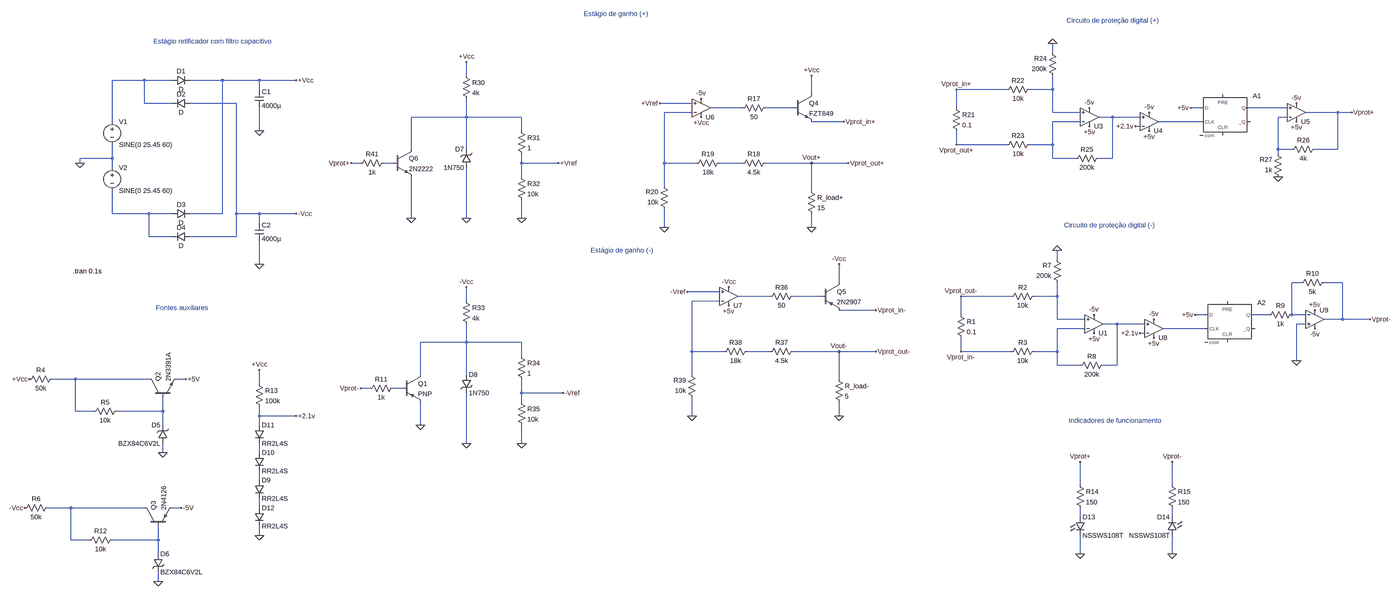
[diagram p0: schematic Fonte.asc, whole sheet]
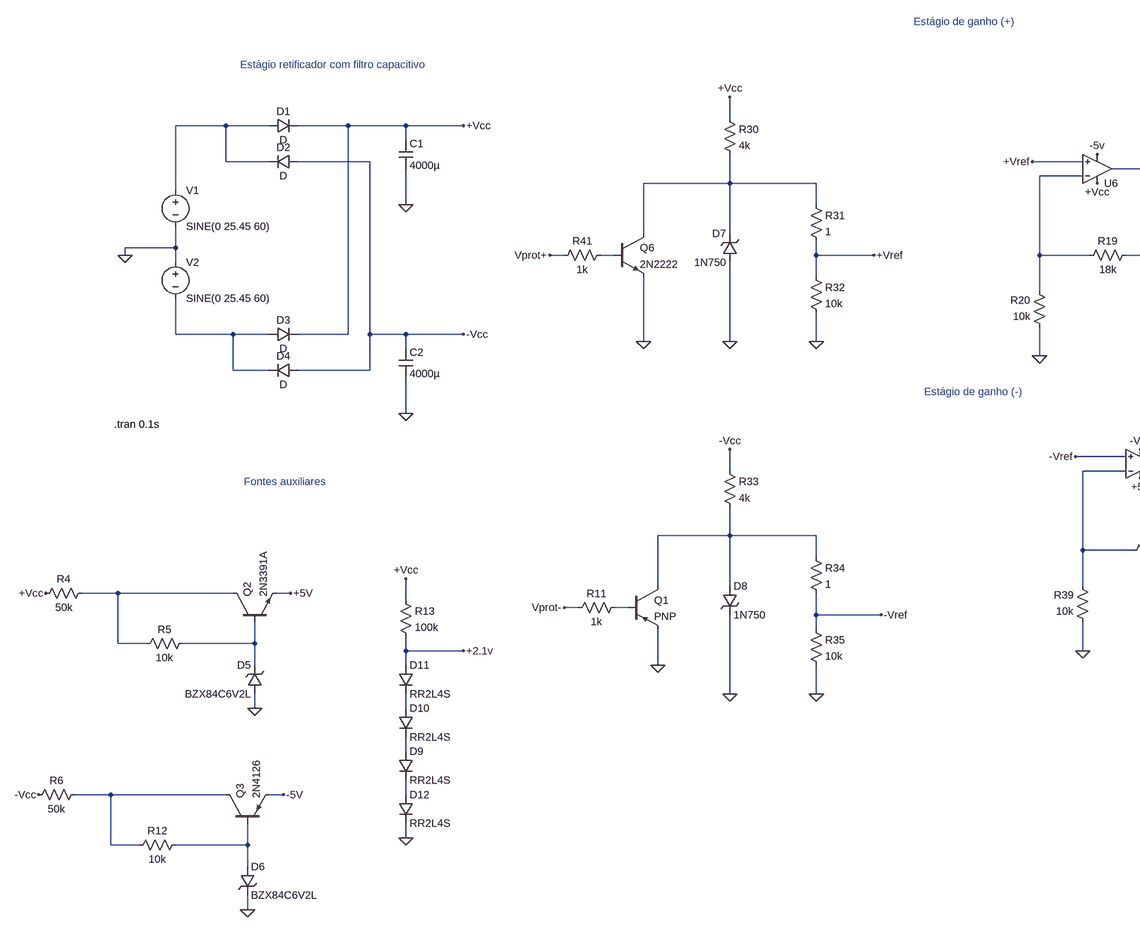
[diagram p1: schematic Fonte.asc, part, row 1 of 1, column 1 of 2]
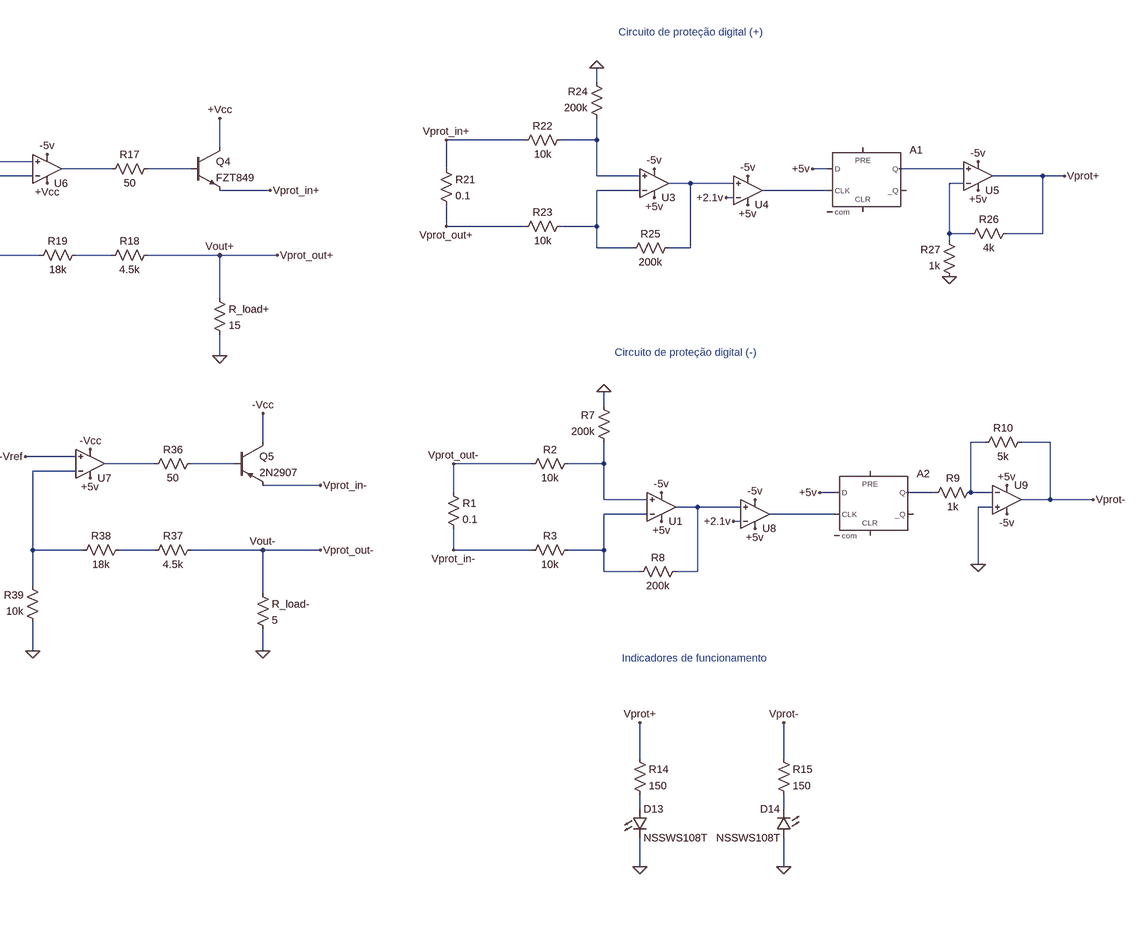
[diagram p2: schematic Fonte.asc, part, row 1 of 1, column 2 of 2]
Fonte.asc, the LTspice schematic file:
Version 4
SHEET 1 8760 7992
WIRE 3504 -208 3504 -240
WIRE 1264 -128 1264 -176
WIRE 144 -112 32 -112
WIRE 240 -112 144 -112
WIRE 416 -112 304 -112
WIRE 544 -112 416 -112
WIRE 672 -112 544 -112
WIRE 544 -80 544 -112
WIRE 3344 -80 3168 -80
WIRE 3504 -80 3504 -128
WIRE 3504 -80 3424 -80
WIRE 2464 -64 2464 -128
WIRE 144 -32 144 -112
WIRE 240 -32 144 -32
WIRE 464 -32 304 -32
WIRE 2048 -32 1936 -32
WIRE 2224 -16 2112 -16
WIRE 2400 -16 2304 -16
WIRE 3168 -16 3168 -80
WIRE 4016 -16 3984 -16
WIRE 4320 -16 4176 -16
WIRE 2048 0 1952 0
WIRE 3504 0 3504 -80
WIRE 3600 0 3504 0
WIRE 4496 0 4384 0
WIRE 4544 0 4496 0
WIRE 1264 16 1264 -48
WIRE 1264 16 1072 16
WIRE 1456 16 1264 16
WIRE 3712 16 3664 16
WIRE 3808 16 3712 16
WIRE 4320 16 4288 16
WIRE 32 32 32 -112
WIRE 2576 32 2464 32
WIRE 3600 32 3504 32
WIRE 4016 32 3872 32
WIRE 3808 48 3792 48
WIRE 544 64 544 -16
WIRE 1456 64 1456 16
WIRE 3168 112 3168 64
WIRE 3344 112 3168 112
WIRE 3504 112 3504 32
WIRE 3504 112 3424 112
WIRE 1072 128 1072 16
WIRE 1264 128 1264 16
WIRE 4288 128 4288 16
WIRE 4336 128 4288 128
WIRE 4496 128 4496 0
WIRE 4496 128 4416 128
WIRE 4288 144 4288 128
WIRE 32 160 32 112
WIRE 32 160 -80 160
WIRE 3504 160 3504 112
WIRE 3584 160 3504 160
WIRE 3712 160 3712 16
WIRE 3712 160 3664 160
WIRE -80 176 -80 160
WIRE 896 176 864 176
WIRE 1008 176 976 176
WIRE 1456 176 1456 144
WIRE 1584 176 1456 176
WIRE 1952 176 1952 0
WIRE 2064 176 1952 176
WIRE 2224 176 2144 176
WIRE 2464 176 2304 176
WIRE 2592 176 2464 176
WIRE 32 192 32 160
WIRE 1456 224 1456 176
WIRE 1952 256 1952 176
WIRE 2464 272 2464 176
WIRE 32 352 32 272
WIRE 160 352 32 352
WIRE 240 352 160 352
WIRE 416 352 416 -112
WIRE 416 352 304 352
WIRE 464 352 464 -32
WIRE 544 352 464 352
WIRE 672 352 544 352
WIRE 1072 368 1072 224
WIRE 1264 368 1264 192
WIRE 1456 368 1456 304
WIRE 544 384 544 352
WIRE 1952 400 1952 336
WIRE 2464 400 2464 352
WIRE 160 432 160 352
WIRE 240 432 160 432
WIRE 464 432 464 352
WIRE 464 432 304 432
WIRE 3520 512 3520 480
WIRE 544 528 544 448
WIRE 2560 592 2560 528
WIRE 4368 592 4336 592
WIRE 4512 592 4448 592
WIRE 2144 624 2032 624
WIRE 2320 640 2208 640
WIRE 2496 640 2400 640
WIRE 3360 640 3184 640
WIRE 3520 640 3520 592
WIRE 3520 640 3440 640
WIRE 1264 656 1264 608
WIRE 2144 656 2048 656
WIRE 2688 688 2560 688
WIRE 3184 704 3184 640
WIRE 4032 704 4000 704
WIRE 4256 704 4192 704
WIRE 4336 704 4336 592
WIRE 4384 704 4336 704
WIRE 3520 720 3520 640
WIRE 3616 720 3520 720
WIRE 4512 720 4512 592
WIRE 4512 720 4448 720
WIRE 4608 720 4512 720
WIRE 3728 736 3680 736
WIRE 3824 736 3728 736
WIRE 4384 736 4352 736
WIRE 3616 752 3520 752
WIRE 4032 752 3888 752
WIRE 3824 768 3808 768
WIRE 1264 800 1264 736
WIRE 1264 800 1104 800
WIRE 1456 800 1264 800
WIRE 2048 832 2048 656
WIRE 2160 832 2048 832
WIRE 2320 832 2240 832
WIRE 2560 832 2400 832
WIRE 2688 832 2560 832
WIRE 3184 832 3184 784
WIRE 3360 832 3184 832
WIRE 3520 832 3520 752
WIRE 3520 832 3440 832
WIRE 1456 848 1456 800
WIRE 4352 864 4352 736
WIRE 3520 880 3520 832
WIRE 3600 880 3520 880
WIRE 3728 880 3728 736
WIRE 3728 880 3680 880
WIRE 1104 912 1104 800
WIRE 1264 912 1264 800
WIRE 2048 912 2048 832
WIRE -96 928 -176 928
WIRE 160 928 -96 928
WIRE 288 928 256 928
WIRE 2560 928 2560 832
WIRE 544 944 544 896
WIRE 928 960 896 960
WIRE 1040 960 1008 960
WIRE 1456 976 1456 928
WIRE 1600 976 1456 976
WIRE 1456 1008 1456 976
WIRE -96 1040 -96 928
WIRE -32 1040 -96 1040
WIRE 208 1040 208 992
WIRE 208 1040 48 1040
WIRE 544 1056 544 1024
WIRE 672 1056 544 1056
WIRE 2048 1056 2048 992
WIRE 2560 1056 2560 1008
WIRE 208 1088 208 1040
WIRE 544 1088 544 1056
WIRE 1104 1088 1104 1008
WIRE 1264 1152 1264 976
WIRE 1456 1152 1456 1088
WIRE 208 1184 208 1152
WIRE 544 1184 544 1152
WIRE 544 1280 544 1248
WIRE 3600 1296 3600 1216
WIRE 3920 1296 3920 1216
WIRE -112 1376 -192 1376
WIRE 144 1376 -112 1376
WIRE 272 1376 240 1376
WIRE 544 1376 544 1344
WIRE 3600 1408 3600 1376
WIRE 3920 1408 3920 1376
WIRE 544 1472 544 1440
WIRE -112 1488 -112 1376
WIRE -48 1488 -112 1488
WIRE 192 1488 192 1440
WIRE 192 1488 32 1488
WIRE 192 1536 192 1488
WIRE 3600 1536 3600 1472
WIRE 3920 1536 3920 1472
WIRE 192 1632 192 1600
FLAG -80 176 0
FLAG 544 64 0
FLAG 544 528 0
FLAG 672 -112 +Vcc
FLAG 672 352 -Vcc
FLAG 3504 -240 0
FLAG 3632 48 +5v
FLAG 3632 -16 -5v
FLAG 3840 0 -5v
FLAG 3840 64 +5v
FLAG 3792 48 +2.1v
FLAG 3984 -16 +5v
FLAG 4288 224 0
FLAG 4544 0 Vprot+
FLAG 3168 -80 Vprot_in+
FLAG 3168 112 Vprot_out+
FLAG 4352 -32 -5v
FLAG 4352 32 +5v
FLAG 1936 -32 +Vref
FLAG 2080 16 +Vcc
FLAG 2080 -48 -5v
FLAG 2464 400 0
FLAG 1952 400 0
FLAG 2464 -128 +Vcc
FLAG 1264 368 0
FLAG 1456 368 0
FLAG 1264 -176 +Vcc
FLAG 1584 176 +Vref
FLAG 1264 1152 0
FLAG 1456 1152 0
FLAG 1264 608 -Vcc
FLAG 1600 976 -Vref
FLAG 2032 624 -Vref
FLAG 2176 672 +5v
FLAG 2176 608 -Vcc
FLAG 2560 1056 0
FLAG 2048 1056 0
FLAG 2560 528 -Vcc
FLAG 864 176 Vprot+
FLAG 1072 368 0
FLAG 2576 32 Vprot_in+
FLAG 2592 176 Vprot_out+
FLAG 2688 688 Vprot_in-
FLAG 2688 832 Vprot_out-
FLAG 3520 480 0
FLAG 3648 768 +5v
FLAG 3648 704 -5v
FLAG 3856 720 -5v
FLAG 3856 784 +5v
FLAG 3808 768 +2.1v
FLAG 4000 704 +5v
FLAG 4352 864 0
FLAG 4608 720 Vprot-
FLAG 3184 640 Vprot_out-
FLAG 3184 832 Vprot_in-
FLAG 4416 752 -5v
FLAG 4416 688 +5v
FLAG 896 960 Vprot-
FLAG 1104 1088 0
FLAG 2560 832 Vout-
FLAG 2464 176 Vout+
FLAG 208 1184 0
FLAG -256 928 +Vcc
FLAG 288 928 +5V
FLAG 192 1632 0
FLAG -272 1376 -Vcc
FLAG 272 1376 -5V
FLAG 544 896 +Vcc
FLAG 544 1472 0
FLAG 672 1056 +2.1v
FLAG 3600 1536 0
FLAG 3920 1536 0
FLAG 3600 1216 Vprot+
FLAG 3920 1216 Vprot-
SYMBOL voltage 32 16 R0
SYMATTR InstName V1
SYMATTR Value SINE(0 25.45 60)
SYMBOL voltage 32 176 R0
SYMATTR InstName V2
SYMATTR Value SINE(0 25.45 60)
SYMBOL diode 240 -96 R270
WINDOW 0 32 32 VTop 2
WINDOW 3 0 32 VBottom 2
SYMATTR InstName D1
SYMBOL diode 304 -48 R90
WINDOW 0 0 32 VBottom 2
WINDOW 3 32 32 VTop 2
SYMATTR InstName D2
SYMBOL diode 240 368 R270
WINDOW 0 32 32 VTop 2
WINDOW 3 0 32 VBottom 2
SYMATTR InstName D3
SYMBOL diode 304 416 R90
WINDOW 0 0 32 VBottom 2
WINDOW 3 32 32 VTop 2
SYMATTR InstName D4
SYMBOL cap 528 -80 R0
SYMATTR InstName C1
SYMATTR Value 4000µ
SYMBOL cap 528 384 R0
SYMATTR InstName C2
SYMATTR Value 4000µ
SYMBOL res 3152 -32 R0
SYMATTR InstName R21
SYMATTR Value 0.1
SYMBOL res 3440 -96 R90
WINDOW 0 0 56 VBottom 2
WINDOW 3 32 56 VTop 2
SYMATTR InstName R22
SYMATTR Value 10k
SYMBOL res 3440 96 R90
WINDOW 0 0 56 VBottom 2
WINDOW 3 32 56 VTop 2
SYMATTR InstName R23
SYMATTR Value 10k
SYMBOL res 3520 -112 R180
WINDOW 0 36 76 Left 2
WINDOW 3 36 40 Left 2
SYMATTR InstName R24
SYMATTR Value 200k
SYMBOL res 3568 176 R270
WINDOW 0 32 56 VTop 2
WINDOW 3 0 56 VBottom 2
SYMATTR InstName R25
SYMATTR Value 200k
SYMBOL Opamps\\UniversalOpamp2 3632 16 M180
SYMATTR InstName U3
SYMBOL Opamps\\UniversalOpamp2 3840 32 M180
SYMATTR InstName U4
SYMBOL Digital\\dflop 4096 -64 R0
SYMATTR InstName A1
SYMBOL Opamps\\UniversalOpamp2 4352 0 M180
SYMATTR InstName U5
SYMBOL res 4432 112 R90
WINDOW 0 0 56 VBottom 2
WINDOW 3 32 56 VTop 2
SYMATTR InstName R26
SYMATTR Value 4k
SYMBOL res 4304 240 R180
WINDOW 0 36 76 Left 2
WINDOW 3 36 40 Left 2
SYMATTR InstName R27
SYMATTR Value 1k
SYMBOL res 2320 -32 R90
WINDOW 0 0 56 VBottom 2
WINDOW 3 32 56 VTop 2
SYMATTR InstName R17
SYMATTR Value 50
SYMBOL res 2320 160 R90
WINDOW 0 0 56 VBottom 2
WINDOW 3 32 56 VTop 2
SYMATTR InstName R18
SYMATTR Value 4.5k
SYMBOL res 2160 160 R90
WINDOW 0 0 56 VBottom 2
WINDOW 3 32 56 VTop 2
SYMATTR InstName R19
SYMATTR Value 18k
SYMBOL res 1968 352 R180
WINDOW 0 36 76 Left 2
WINDOW 3 36 40 Left 2
SYMATTR InstName R20
SYMATTR Value 10k
SYMBOL res 2448 256 R0
SYMATTR InstName R_load+
SYMATTR Value 15
SYMBOL npn 2400 -64 R0
SYMATTR InstName Q4
SYMATTR Value FZT849
SYMBOL OpAmps\\UniversalOpamp2 2080 -16 M180
SYMATTR InstName U6
SYMBOL res 1248 -144 R0
SYMATTR InstName R30
SYMATTR Value 4k
SYMBOL zener 1280 192 R180
WINDOW 0 24 64 Left 2
WINDOW 3 24 0 Left 2
SYMATTR InstName D7
SYMATTR Value 1N750
SYMBOL res 1440 48 R0
SYMATTR InstName R31
SYMATTR Value 1
SYMBOL res 1440 208 R0
SYMATTR InstName R32
SYMATTR Value 10k
SYMBOL res 1248 640 R0
SYMATTR InstName R33
SYMATTR Value 4k
SYMBOL zener 1248 912 R0
SYMATTR InstName D8
SYMATTR Value 1N750
SYMBOL res 1440 832 R0
SYMATTR InstName R34
SYMATTR Value 1
SYMBOL res 1440 992 R0
SYMATTR InstName R35
SYMATTR Value 10k
SYMBOL res 2416 624 R90
WINDOW 0 0 56 VBottom 2
WINDOW 3 32 56 VTop 2
SYMATTR InstName R36
SYMATTR Value 50
SYMBOL res 2416 816 R90
WINDOW 0 0 56 VBottom 2
WINDOW 3 32 56 VTop 2
SYMATTR InstName R37
SYMATTR Value 4.5k
SYMBOL res 2256 816 R90
WINDOW 0 0 56 VBottom 2
WINDOW 3 32 56 VTop 2
SYMATTR InstName R38
SYMATTR Value 18k
SYMBOL res 2064 1008 R180
WINDOW 0 36 76 Left 2
WINDOW 3 36 40 Left 2
SYMATTR InstName R39
SYMATTR Value 10k
SYMBOL res 2544 912 R0
SYMATTR InstName R_load-
SYMATTR Value 5
SYMBOL OpAmps\\UniversalOpamp2 2176 640 M180
SYMATTR InstName U7
SYMBOL pnp 2496 592 R0
SYMATTR InstName Q5
SYMATTR Value 2N2907
SYMBOL npn 1008 128 R0
SYMATTR InstName Q6
SYMATTR Value 2N2222
SYMBOL res 992 160 R90
WINDOW 0 0 56 VBottom 2
WINDOW 3 32 56 VTop 2
SYMATTR InstName R41
SYMATTR Value 1k
SYMBOL res 3168 688 R0
SYMATTR InstName R1
SYMATTR Value 0.1
SYMBOL res 3456 624 R90
WINDOW 0 0 56 VBottom 2
WINDOW 3 32 56 VTop 2
SYMATTR InstName R2
SYMATTR Value 10k
SYMBOL res 3456 816 R90
WINDOW 0 0 56 VBottom 2
WINDOW 3 32 56 VTop 2
SYMATTR InstName R3
SYMATTR Value 10k
SYMBOL res 3536 608 R180
WINDOW 0 36 76 Left 2
WINDOW 3 36 40 Left 2
SYMATTR InstName R7
SYMATTR Value 200k
SYMBOL res 3584 896 R270
WINDOW 0 32 56 VTop 2
WINDOW 3 0 56 VBottom 2
SYMATTR InstName R8
SYMATTR Value 200k
SYMBOL Opamps\\UniversalOpamp2 3648 736 M180
SYMATTR InstName U1
SYMBOL Opamps\\UniversalOpamp2 3856 752 M180
SYMATTR InstName U8
SYMBOL Digital\\dflop 4112 656 R0
SYMATTR InstName A2
SYMBOL Opamps\\UniversalOpamp2 4416 720 R0
SYMATTR InstName U9
SYMBOL res 1024 944 R90
WINDOW 0 0 56 VBottom 2
WINDOW 3 32 56 VTop 2
SYMATTR InstName R11
SYMATTR Value 1k
SYMBOL pnp 1040 912 R0
SYMATTR InstName Q1
SYMBOL res 4352 688 R90
WINDOW 0 0 56 VBottom 2
WINDOW 3 32 56 VTop 2
SYMATTR InstName R9
SYMATTR Value 1k
SYMBOL res 4464 576 R90
WINDOW 0 0 56 VBottom 2
WINDOW 3 32 56 VTop 2
SYMATTR InstName R10
SYMATTR Value 5k
SYMBOL res -160 912 R90
WINDOW 0 0 56 VBottom 2
WINDOW 3 32 56 VTop 2
SYMATTR InstName R4
SYMATTR Value 50k
SYMBOL res 64 1024 R90
WINDOW 0 0 56 VBottom 2
WINDOW 3 32 56 VTop 2
SYMATTR InstName R5
SYMATTR Value 10k
SYMBOL zener 224 1152 R180
WINDOW 0 24 64 Left 2
WINDOW 3 24 0 Left 2
SYMATTR InstName D5
SYMATTR Value BZX84C6V2L
SYMBOL npn 160 992 R270
SYMATTR InstName Q2
SYMATTR Value 2N3391A
SYMBOL res -176 1360 R90
WINDOW 0 0 56 VBottom 2
WINDOW 3 32 56 VTop 2
SYMATTR InstName R6
SYMATTR Value 50k
SYMBOL res 48 1472 R90
WINDOW 0 0 56 VBottom 2
WINDOW 3 32 56 VTop 2
SYMATTR InstName R12
SYMATTR Value 10k
SYMBOL zener 176 1536 R0
SYMATTR InstName D6
SYMATTR Value BZX84C6V2L
SYMBOL pnp 144 1440 R270
SYMATTR InstName Q3
SYMATTR Value 2N4126
SYMBOL diode 528 1280 R0
SYMATTR InstName D9
SYMATTR Value RR2L4S
SYMBOL diode 528 1184 R0
SYMATTR InstName D10
SYMATTR Value RR2L4S
SYMBOL diode 528 1088 R0
SYMATTR InstName D11
SYMATTR Value RR2L4S
SYMBOL res 528 928 R0
SYMATTR InstName R13
SYMATTR Value 100k
SYMBOL diode 528 1376 R0
SYMATTR InstName D12
SYMATTR Value RR2L4S
SYMBOL LED 3584 1408 R0
SYMATTR InstName D13
SYMATTR Value NSSWS108T
SYMATTR Description Diode
SYMATTR Type diode
SYMBOL LED 3936 1472 R180
WINDOW 0 24 64 Left 2
WINDOW 3 24 0 Left 2
SYMATTR InstName D14
SYMATTR Value NSSWS108T
SYMATTR Description Diode
SYMATTR Type diode
SYMBOL res 3584 1280 R0
SYMATTR InstName R14
SYMATTR Value 150
SYMBOL res 3904 1280 R0
SYMATTR InstName R15
SYMATTR Value 150
TEXT 176 -248 Left 2 ;Estágio retificador com filtro capacitivo
TEXT -104 552 Left 2 !.tran 0.1s
TEXT 184 680 Left 2 ;Fontes auxiliares
TEXT 1672 -344 Left 2 ;Estágio de ganho (+)
TEXT 1696 480 Left 2 ;Estágio de ganho (-)
TEXT 3552 -320 Left 2 ;Circuito de proteção digital (+)
TEXT 3544 392 Left 2 ;Circuito de proteção digital (-)
TEXT 3560 1072 Left 2 ;Indicadores de funcionamento

The netlist it stands for:
* Fonte.asc
V1 N001 0 SINE(0 25.45 60)
V2 0 N014 SINE(0 25.45 60)
D1 N001 +Vcc D
D2 -Vcc N001 D
D3 N014 +Vcc D
D4 -Vcc N014 D
C1 +Vcc 0 4000µ
C2 -Vcc 0 4000µ
R21 Vprot_in+ Vout+ 0.1
R22 N002 Vprot_in+ 10k
R23 N010 Vout+ 10k
R24 N002 0 200k
R25 N010 N008 200k
XU3 N002 N010 +5v -5v N008 level.2 Avol=1Meg GBW=10Meg Slew=10Meg ilimit=25m rail=0 Vos=0 phimargin=45 en=0 enk=0 in=0 ink=0 Rin=500Meg  ; pins IN+ IN- V+ V- OUT
XU4 N008 +2.1v +5v -5v N011 level.2 Avol=1Meg GBW=10Meg Slew=10Meg ilimit=25m rail=0 Vos=0 phimargin=45 en=0 enk=0 in=0 ink=0 Rin=500Meg  ; pins IN+ IN- V+ V- OUT
A1 +5v 0 N011 0 0 0 N005 0 DFLOP
XU5 N005 N009 +5v -5v Vprot+ level.2 Avol=1Meg GBW=10Meg Slew=10Meg ilimit=25m rail=0 Vos=0 phimargin=45 en=0 enk=0 in=0 ink=0 Rin=500Meg  ; pins IN+ IN- V+ V- OUT
R26 Vprot+ N009 4k
R27 0 N009 1k
R17 N004 N003 50
R18 Vout+ N013 4.5k
R19 N013 N006 18k
R20 0 N006 10k
R_load+ Vout+ 0 15
Q4 +Vcc N004 Vprot_in+ 0 FZT849
XU6 +Vref N006 +Vcc -5v N003 level.2 Avol=1Meg GBW=10Meg Slew=10Meg ilimit=25m rail=0 Vos=0 phimargin=45 en=0 enk=0 in=0 ink=0 Rin=500Meg  ; pins IN+ IN- V+ V- OUT
R30 +Vcc N007 4k
D7 0 N007 1N750
R31 N007 +Vref 1
R32 +Vref 0 10k
R33 -Vcc N024 4k
D8 N024 0 1N750
R34 N024 -Vref 1
R35 -Vref 0 10k
R36 N017 N016 50
R37 Vout- N025 4.5k
R38 N025 N019 18k
R39 0 N019 10k
R_load- Vout- 0 5
XU7 -Vref N019 +5v -Vcc N016 level.2 Avol=1Meg GBW=10Meg Slew=10Meg ilimit=25m rail=0 Vos=0 phimargin=45 en=0 enk=0 in=0 ink=0 Rin=500Meg  ; pins IN+ IN- V+ V- OUT
Q5 -Vcc N017 Vprot_in- 0 2N2907
Q6 N007 N012 0 0 2N2222
R41 N012 Vprot+ 1k
R1 Vout- Vprot_in- 0.1
R2 N018 Vout- 10k
R3 N022 Vprot_in- 10k
R7 N018 0 200k
R8 N022 N021 200k
XU1 N018 N022 +5v -5v N021 level.2 Avol=1Meg GBW=10Meg Slew=10Meg ilimit=25m rail=0 Vos=0 phimargin=45 en=0 enk=0 in=0 ink=0 Rin=500Meg  ; pins IN+ IN- V+ V- OUT
XU8 N021 +2.1v +5v -5v N023 level.2 Avol=1Meg GBW=10Meg Slew=10Meg ilimit=25m rail=0 Vos=0 phimargin=45 en=0 enk=0 in=0 ink=0 Rin=500Meg  ; pins IN+ IN- V+ V- OUT
A2 +5v 0 N023 0 0 0 N020 0 DFLOP
XU9 0 N015 +5v -5v Vprot- level.2 Avol=1Meg GBW=10Meg Slew=10Meg ilimit=25m rail=0 Vos=0 phimargin=45 en=0 enk=0 in=0 ink=0 Rin=500Meg  ; pins IN+ IN- V+ V- OUT
R11 N027 Vprot- 1k
Q1 N024 N027 0 0 PNP
R9 N015 N020 1k
R10 Vprot- N015 5k
R4 N026 +Vcc 50k
R5 N028 N026 10k
D5 0 N028 BZX84C6V2L
Q2 N026 N028 +5v 0 2N3391A
R6 N031 -Vcc 50k
R12 N035 N031 10k
D6 N035 0 BZX84C6V2L
Q3 N031 N035 -5v 0 2N4126
D9 N030 N032 RR2L4S
D10 N029 N030 RR2L4S
D11 +2.1v N029 RR2L4S
R13 +Vcc +2.1v 100k
D12 N032 0 RR2L4S
D13 N033 0 NSSWS108T
D14 0 N034 NSSWS108T
R14 Vprot+ N033 150
R15 Vprot- N034 150
.model D D
.lib standard.dio
.model NPN NPN
.model PNP PNP
.lib standard.bjt
* Estágio retificador com filtro capacitivo
.tran 0.1s
* Fontes auxiliares
* Estágio de ganho (+)
* Estágio de ganho (-)
* Circuito de proteção digital (+)
* Circuito de proteção digital (-)
* Indicadores de funcionamento
.lib UniversalOpamps2.sub
.backanno
.end